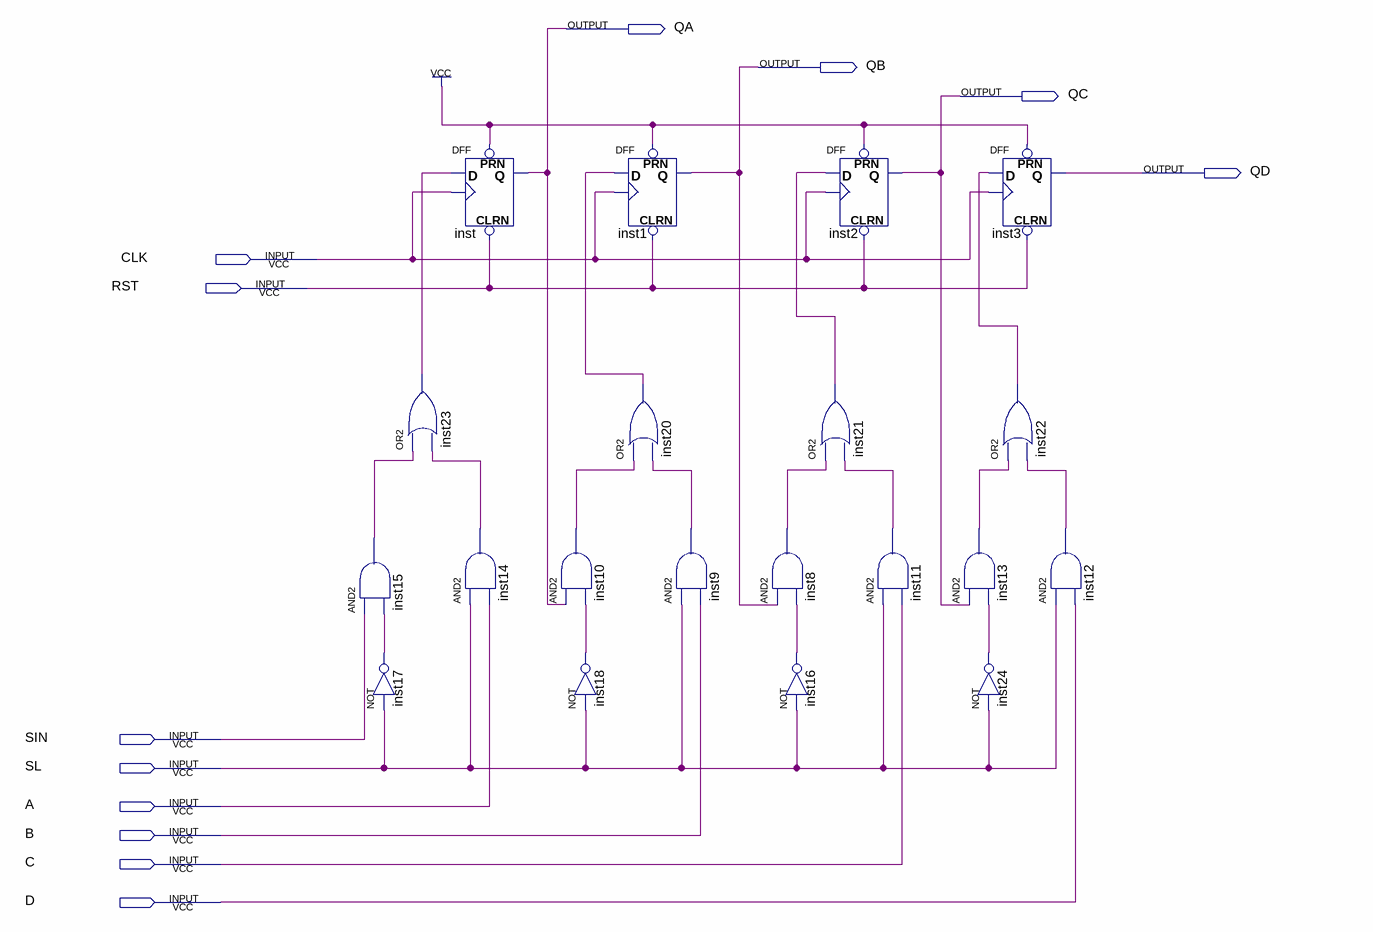
[diagram p0: schematic sheet]
// Quartus schematic Exercise8_2.bdf as structural Verilog: 20 symbols, 12 pins
module Exercise8_2 (
  input  CLK,
  input  RST,
  input  SIN,
  input  SL,
  input  A,
  input  B,
  input  C,
  input  D,
  output QA,
  output QB,
  output QC,
  output QD
);

  wire inst8_out, inst9_out, inst10_out, inst11_out, inst12_out, inst13_out, inst14_out, inst15_out,
       inst16_out, inst17_out, inst18_out, inst20_out, inst21_out, inst22_out, inst23_out, inst24_out;

  or inst23 (inst23_out, inst15_out, inst14_out);
  and inst15 (inst15_out, SIN, inst17_out);
  not inst17 (inst17_out, SL);
  DFF inst (.CLRN(RST), .CLK(CLK), .D(inst23_out), .PRN(1'b1), .Q(QA));
  and inst14 (inst14_out, SL, A);
  and inst10 (inst10_out, QA, inst18_out);
  not inst18 (inst18_out, SL);
  DFF inst1 (.CLRN(RST), .CLK(CLK), .D(inst20_out), .PRN(1'b1), .Q(QB));
  or inst20 (inst20_out, inst10_out, inst9_out);
  and inst9 (inst9_out, SL, B);
  and inst8 (inst8_out, QB, inst16_out);
  not inst16 (inst16_out, SL);
  DFF inst2 (.CLRN(RST), .CLK(CLK), .D(inst21_out), .PRN(1'b1), .Q(QC));
  or inst21 (inst21_out, inst8_out, inst11_out);
  and inst11 (inst11_out, SL, C);
  and inst13 (inst13_out, QC, inst24_out);
  DFF inst3 (.CLRN(RST), .CLK(CLK), .D(inst22_out), .PRN(1'b1), .Q(QD));
  or inst22 (inst22_out, inst13_out, inst12_out);
  not inst24 (inst24_out, SL);
  and inst12 (inst12_out, SL, D);
endmodule
